# EAGLE design sensor (EAGLE 4.16)
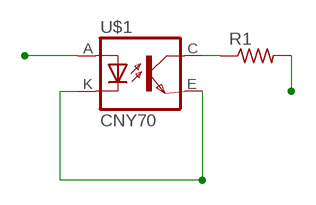
[diagram p0: schematic, sheet 1]

## Parts
R1  R-US_0204/7  [0204/7]
U$1  CNY70  [4]

## Nets
N$1: R1.1 U$1.C(COL)
N$3: U$1.A
N$4: R1.2
N$7: U$1.E(EMI) U$1.K(C)

## Library data of the parts
R1 = rcl:R-US_: RESISTOR, American symbol
U$1 = cny70:CNY70

## Board
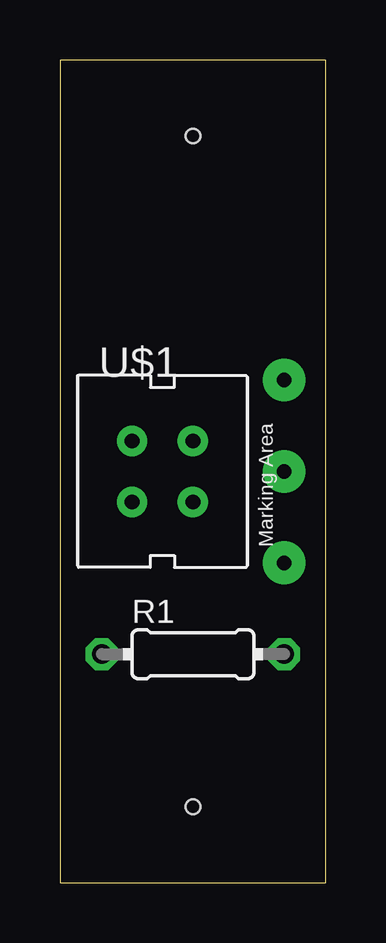
[diagram p1: board, top side]
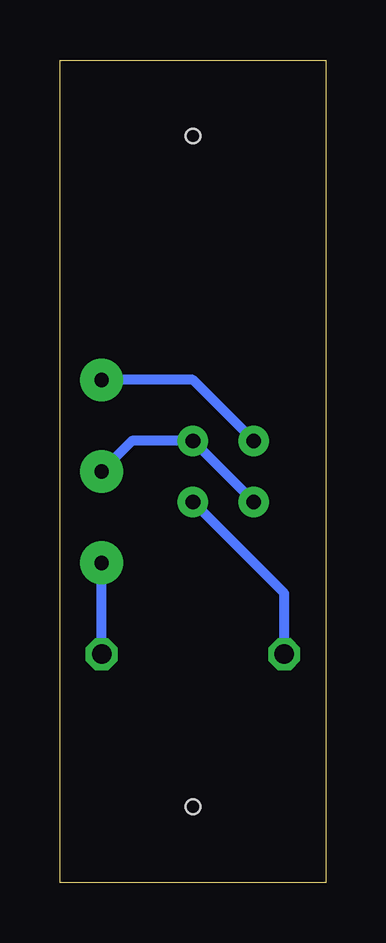
[diagram p2: board, bottom side, seen from below]

Size 11.1 x 34.28 mm. Coordinates in mm from the lower left corner, seen from the top.
Outline: 0,0 11.1,0 11.1,34.28 0,34.28 0,0
Copper layers 16: Bottom 0.035mm
Design rules "default": minimum track width 10mil, minimum drill 24mil, track to track 8mil, track to pad 8mil, pad to pad 8mil, via to via 8mil, smd to smd 8mil, copper to edge 40mil, drill to drill 8mil, minimum pad ring 10mil, minimum via ring 8mil, stop-mask expansion 4mil, vias tented up to drill 0mil, thermal gap 10mil
Holes 0.6 mm at 5.55,3.17 5.55,31.11

### Footprints (pad centres in the part's own frame; a part is rotated, then mirrored left to right if it is on the bottom)
0204/7 = drill 0.813 octagon: 1 -3.81,0; 2 3.81,0
4 = drill 0.61 pad 1.27 round: A -1.27,1.27; C 1.27,-1.27; E 1.27,1.27; K -1.27,-1.27

### Placement (x,y rotation side)
R1  5.55,9.52 0 top
U$1  4.28,17.14 0 top

### Tracks (layer width: path | path; a pad name or v marks a point on that pad's centre or on a via)
N$1
  Bottom 0.406: U$1.C 1.74,12.06 R1.1
N$3  (via drill 0.6 pad 1.78)
  Bottom 0.406: U$1.A 5.55,20.95 v9.36,20.95
N$4  (via drill 0.6 pad 1.78)
  Bottom 0.406: R1.2 v9.36,13.33
N$7  (via drill 0.6 pad 1.78)
  Bottom 0.406: U$1.K U$1.E 8.09,18.41 v9.36,17.14